# EAGLE design 5-leds (EAGLE 7.1.0)
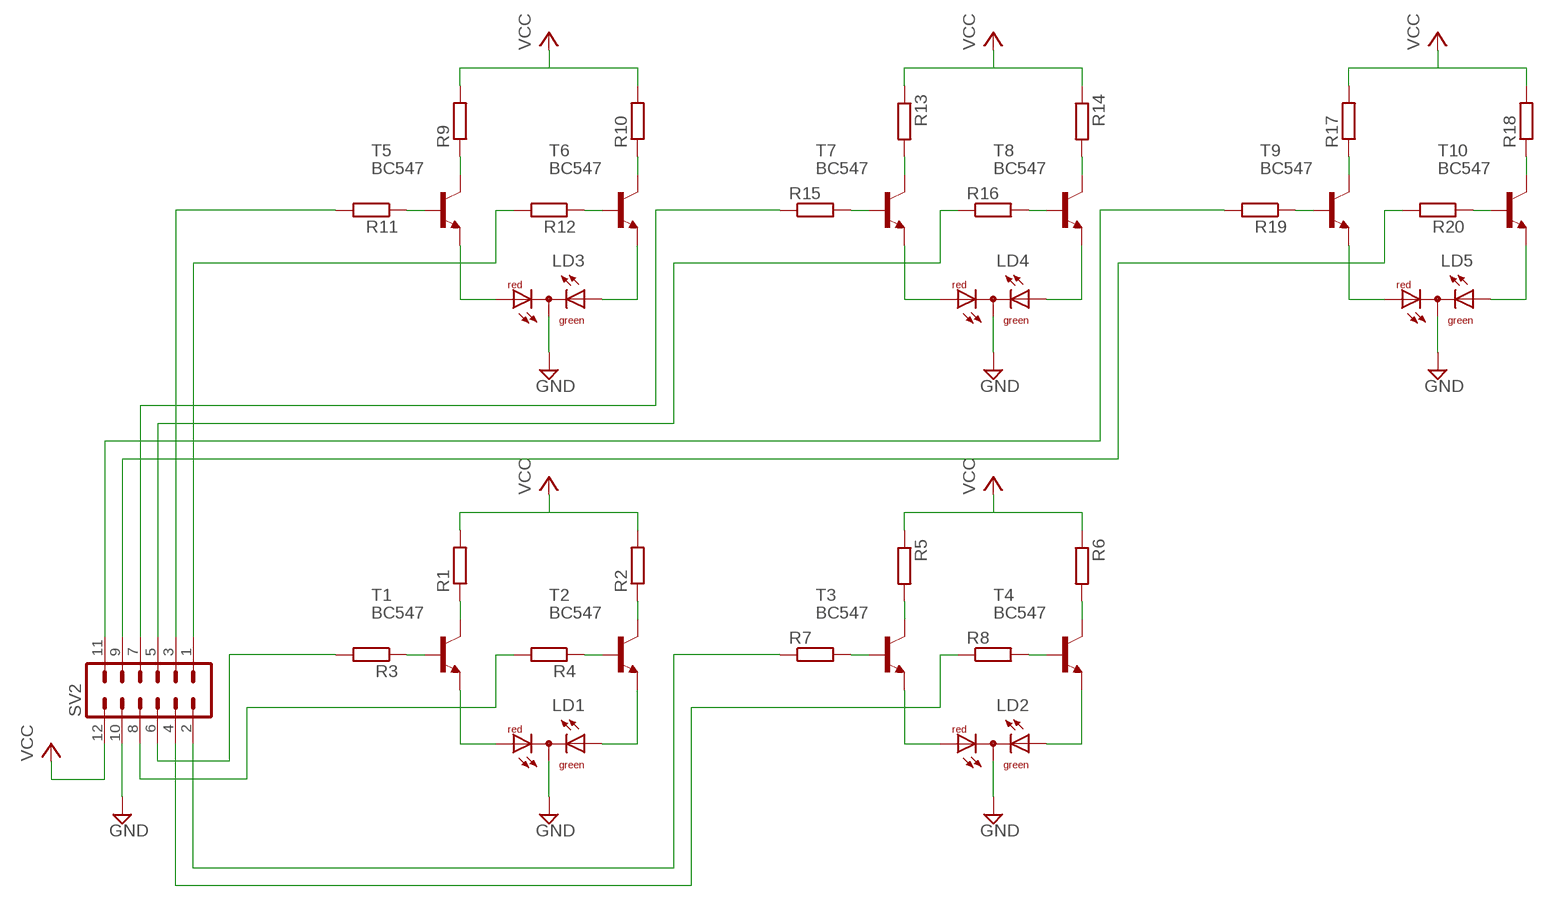
[diagram p0: schematic, sheet 1]

## Parts
LD1  DUOLED-RG-C  [DUOLED-C-5MM]
LD2  DUOLED-RG-C  [DUOLED-C-5MM]
LD3  DUOLED-RG-C  [DUOLED-C-5MM]
LD4  DUOLED-RG-C  [DUOLED-C-5MM]
LD5  DUOLED-RG-C  [DUOLED-C-5MM]
R1  R-EU_0207/7  [0207/7]
R2  R-EU_0207/7  [0207/7]
R3  R-EU_0207/7  [0207/7]
R4  R-EU_0207/7  [0207/7]
R5  R-EU_0207/7  [0207/7]
R6  R-EU_0207/7  [0207/7]
R7  R-EU_0207/7  [0207/7]
R8  R-EU_0207/7  [0207/7]
R9  R-EU_0207/7  [0207/7]
R10  R-EU_0207/7  [0207/7]
R11  R-EU_0207/7  [0207/7]
R12  R-EU_0207/7  [0207/7]
R13  R-EU_0207/7  [0207/7]
R14  R-EU_0207/7  [0207/7]
R15  R-EU_0207/7  [0207/7]
R16  R-EU_0207/7  [0207/7]
R17  R-EU_0207/7  [0207/7]
R18  R-EU_0207/7  [0207/7]
R19  R-EU_0207/7  [0207/7]
R20  R-EU_0207/7  [0207/7]
SV2  MA06-2  [MA06-2]
T1  BC547  [TO92]
T2  BC547  [TO92]
T3  BC547  [TO92]
T4  BC547  [TO92]
T5  BC547  [TO92]
T6  BC547  [TO92]
T7  BC547  [TO92]
T8  BC547  [TO92]
T9  BC547  [TO92]
T10  BC547  [TO92]

## Nets
GND: LD1.C LD2.C LD3.C LD4.C LD5.C SV2.10
N$1: LD1.AR T1.1(E)
N$2: LD1.AX(AG) T2.1(E)
N$3: R3.1 T1.2(B)
N$4: R4.1 T2.2(B)
N$5: R4.2 SV2.8
N$6: R3.2 SV2.6
N$7: R1.1 T1.3(C)
N$8: R2.1 T2.3(C)
N$10: LD2.AR T3.1(E)
N$11: LD2.AX(AG) T4.1(E)
N$12: R8.1 SV2.4
N$13: R5.2 T3.3(C)
N$14: R6.2 T4.3(C)
N$15: R7.2 T3.2(B)
N$16: R8.2 T4.2(B)
N$17: R7.1 SV2.2
N$18: LD3.AR T5.1(E)
N$19: LD3.AX(AG) T6.1(E)
N$20: R12.2 SV2.1
N$21: R9.1 T5.3(C)
N$22: R10.1 T6.3(C)
N$23: R11.1 T5.2(B)
N$24: R12.1 T6.2(B)
N$25: R11.2 SV2.3
N$26: LD4.AR T7.1(E)
N$27: LD4.AX(AG) T8.1(E)
N$28: R16.1 SV2.5
N$29: R13.2 T7.3(C)
N$30: R14.2 T8.3(C)
N$31: R15.2 T7.2(B)
N$32: R16.2 T8.2(B)
N$33: R15.1 SV2.7
N$34: LD5.AR T9.1(E)
N$35: LD5.AX(AG) T10.1(E)
N$36: R20.2 SV2.9
N$37: R17.1 T9.3(C)
N$38: R18.1 T10.3(C)
N$39: R19.1 T9.2(B)
N$40: R20.1 T10.2(B)
N$41: R19.2 SV2.11
VCC: R1.2 R2.2 R5.1 R6.1 R9.2 R10.2 R13.1 R14.1 R17.2 R18.2 SV2.12

## Library data of the parts
LD1-LD5 = led:DUOLED-RG-C: DUO LED 2 colors (red/green), 5 mm, round, common Cathode www.ligitek.com or other producers.
R1-R20 = rcl:R-EU_: RESISTOR, European symbol
SV2 = con-lstb:MA06-2: PIN HEADER; OC_FARNELL: unknown; OC_NEWARK: unknown
T1-T10 = transistor:BC547: NPN TRANSISTOR

## Board
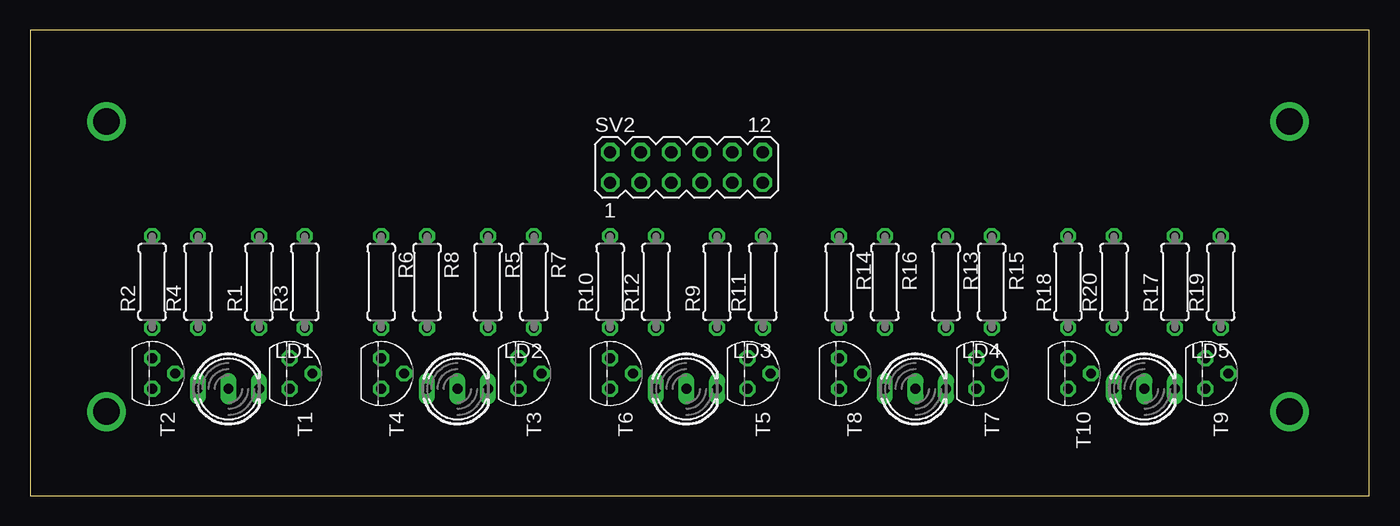
[diagram p1: board, top side]
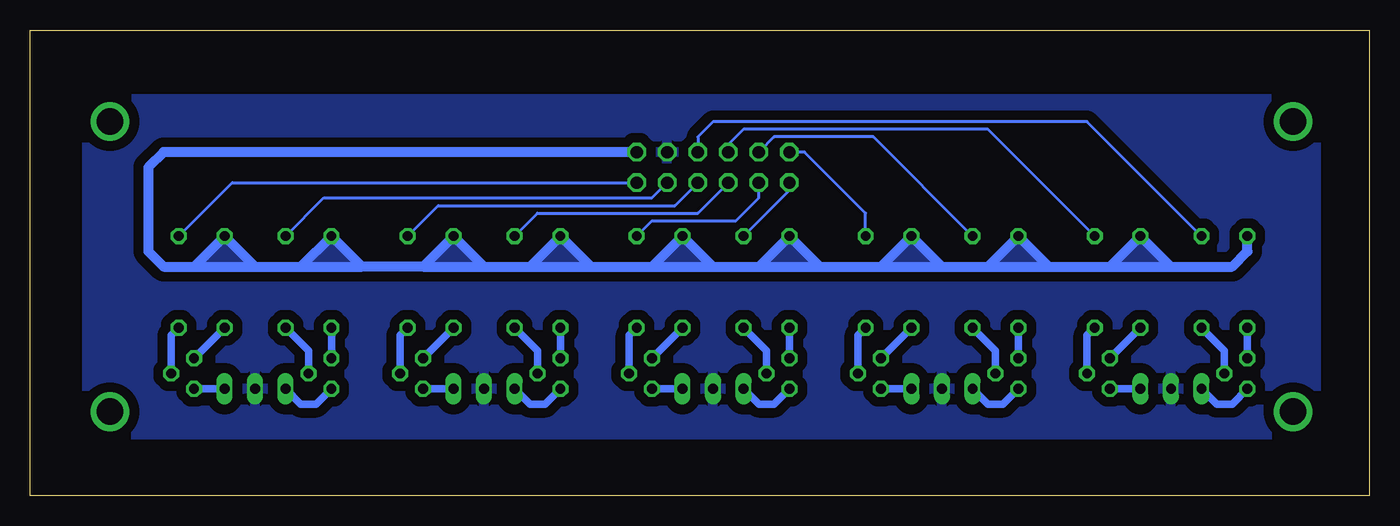
[diagram p2: board, bottom side, seen from below]

Size 111.43 x 38.73 mm. Coordinates in mm from the lower left corner, seen from the top.
Outline: 0,0 111.43,0 111.43,38.73 0,38.73 0,0
Copper layers (1*16): Top 0.035mm / dielectric 1.5mm / Bottom 0.035mm
Design rules "default": minimum track width 10mil, minimum drill 24mil, track to track 8mil, track to pad 8mil, pad to pad 8mil, via to via 8mil, smd to smd 8mil, copper to edge 40mil, drill to drill 8mil, minimum pad ring 10mil, minimum via ring 8mil, stop-mask expansion 4mil, vias tented up to drill 0mil, thermal gap 10mil

### Footprints (pad centres in the part's own frame; a part is rotated, then mirrored left to right if it is on the bottom)
DUOLED-C-5MM = drill 0.813 long: AR 2.54,0; AX -2.54,0; C 0,0
0207/7 = drill 0.813 octagon: 1 -3.81,0; 2 3.81,0
MA06-2 = drill 1.016 octagon: 1 -6.35,-1.27; 2 -6.35,1.27; 3 -3.81,-1.27; 4 -3.81,1.27; 5 -1.27,-1.27; 6 -1.27,1.27; 7 1.27,-1.27; 8 1.27,1.27; 9 3.81,-1.27; 10 3.81,1.27; 11 6.35,-1.27; 12 6.35,1.27
TO92 = drill 0.813 octagon: 1 1.27,0; 2 0,1.905; 3 -1.27,0

### Placement (x,y rotation side)
LD1  16.51,8.89 0 top
LD2  35.56,8.89 0 top
LD3  54.61,8.89 0 top
LD4  73.66,8.89 0 top
LD5  92.71,8.89 0 top
R1  19.05,17.78 90 top
R2  10.16,17.78 90 top
R3  22.86,17.78 90 top
R4  13.97,17.78 90 top
R5  38.1,17.78 270 top
R6  29.21,17.78 270 top
R7  41.91,17.78 270 top
R8  33.02,17.78 270 top
R9  57.15,17.78 90 top
R10  48.26,17.78 90 top
R11  60.96,17.78 90 top
R12  52.07,17.78 90 top
R13  76.2,17.78 270 top
R14  67.31,17.78 270 top
R15  80.01,17.78 270 top
R16  71.12,17.78 270 top
R17  95.25,17.78 90 top
R18  86.36,17.78 90 top
R19  99.06,17.78 90 top
R20  90.17,17.78 90 top
SV2  54.61,27.3 0 top
T1  21.59,10.16 270 top
T2  10.16,10.16 270 top
T3  40.64,10.16 270 top
T4  29.21,10.16 270 top
T5  59.69,10.16 270 top
T6  48.26,10.16 270 top
T7  78.74,10.16 270 top
T8  67.31,10.16 270 top
T9  97.79,10.16 270 top
T10  86.36,10.16 270 top

### Tracks (layer width: path | path; a pad name or v marks a point on that pad's centre or on a via)
GND
  pour Bottom (isolate 0.813): 4.45,5.08 106.68,5.08 106.68,33.02 4.45,33.02
N$1
  Bottom 0.61: T1.1 LD1.AR
N$2
  Bottom 0.61: T2.1 11.43,7.62 12.7,7.62 LD1.AX
N$3
  Bottom 0.61: T1.2 23.5,13.34 R3.1
N$4
  Bottom 0.61: T2.2 12.06,12.06 R4.1
N$5
  Bottom 0.254: R4.2 23.5,31.11 54.61,31.11 55.88,29.84 SV2.8
N$6
  Bottom 0.254: R3.2 31.75,30.48 52.07,30.48 53.34,29.21 SV2.6
N$7
  Bottom 0.61: T1.3 R1.1
N$8
  Bottom 0.61: T2.3 R2.1
N$9  (via drill 2.2 pad 1.93)
  other vias: 6.35,31.11
N$10
  Bottom 0.61: LD2.AR T3.1
N$11
  Bottom 0.61: LD2.AX 31.75,7.62 30.48,7.62 T4.1
N$12
  Bottom 0.254: R8.1 41.27,29.84 49.53,29.84 SV2.4
N$13
  Bottom 0.61: T3.3 R5.2
N$14
  Bottom 0.61: T4.3 R6.2
N$15
  Bottom 0.61: T3.2 42.55,13.34 R7.2
N$16
  Bottom 0.61: T4.2 31.11,12.06 R8.2
N$17
  Bottom 0.254: R7.1 41.91,23.5 46.99,28.57 SV2.2
N$18
  Bottom 0.61: LD3.AR T5.1
N$19
  Bottom 0.61: LD3.AX 50.8,7.62 49.53,7.62 T6.1
N$20
  Bottom 0.254: R12.2 48.26,25.4 SV2.1
N$21
  Bottom 0.61: T5.3 R9.1
N$22
  Bottom 0.61: T6.3 R10.1
N$23
  Bottom 0.61: T5.2 61.59,13.34 R11.1
N$24
  Bottom 0.61: T6.2 50.16,12.06 R12.1
N$25
  Bottom 0.254: R11.2 59.69,22.86 52.7,22.86 50.8,24.77 SV2.3
N$26
  Bottom 0.61: T7.1 LD4.AR
N$27
  Bottom 0.61: LD4.AX 69.85,7.62 68.58,7.62 T8.1
N$28
  Bottom 0.254: R16.1 69.22,23.5 55.88,23.5 SV2.5
N$29
  Bottom 0.61: T7.3 R13.2
N$30
  Bottom 0.61: T8.3 R14.2
N$31
  Bottom 0.61: T7.2 80.64,13.34 R15.2
N$32
  Bottom 0.61: T8.2 69.22,12.06 R16.2
N$33
  Bottom 0.254: R15.1 77.47,24.13 57.78,24.13 SV2.7
N$34
  Bottom 0.61: T9.1 LD5.AR
N$35
  Bottom 0.61: LD5.AX 88.9,7.62 87.63,7.62 T10.1
N$36
  Bottom 0.254: R20.2 87,24.77 59.69,24.77 SV2.9
N$37
  Bottom 0.61: T9.3 R17.1
N$38
  Bottom 0.61: T10.3 R18.1
N$39
  Bottom 0.61: T9.2 99.69,13.34 R19.1
N$40
  Bottom 0.61: T10.2 88.27,12.06 R20.1
N$41
  Bottom 0.254: R19.2 94.61,26.04 SV2.11
N$42  (via drill 2.2 pad 1.93)
  other vias: 6.35,6.99
N$43  (via drill 2.2 pad 1.93)
  other vias: 104.78,6.99
N$44  (via drill 2.2 pad 1.93)
  other vias: 104.78,31.11
VCC
  Bottom 0.813: SV2.12 100.33,28.57 101.6,27.3 101.6,20.32 100.33,19.05 97.79,19.05 | 97.79,19.05 88.9,19.05 | 88.9,19.05 83.82,19.05 | 78.74,19.05 73.66,19.05 | 73.66,19.05 69.85,19.05 | 69.85,19.05 64.77,19.05 | 64.77,19.05 59.69,19.05 | 59.69,19.05 54.61,19.05 | 54.61,19.05 50.8,19.05 | 50.8,19.05 45.72,19.05 | 45.72,19.05 40.64,19.05 | 40.64,19.05 35.56,19.05 | 35.56,19.05 31.75,19.05 | 31.75,19.05 26.67,19.05 | 26.67,19.05 21.59,19.05 | 21.59,19.05 16.51,19.05 | 16.51,19.05 11.43,19.05 10.16,20.32 R2.2 | 16.51,19.05 R1.2 21.59,19.05 | 26.67,19.05 R6.1 31.75,19.05 | 35.56,19.05 R5.1 40.64,19.05 | 45.72,19.05 R10.2 50.8,19.05 | 54.61,19.05 R9.2 59.69,19.05 | 64.77,19.05 R14.1 69.85,19.05 | 73.66,19.05 R13.1 78.74,19.05 | 78.74,19.05 83.82,19.05 | 83.82,19.05 R18.2 88.9,19.05 | 92.71,19.05 R17.2 97.79,19.05
  pour Bottom: 19.05,21.59 16.51,19.05 21.59,19.05
  pour Bottom: 29.21,21.59 26.67,19.05 31.75,19.05
  pour Bottom: 38.1,21.59 35.56,19.05 40.64,19.05
  pour Bottom: 48.26,21.59 45.72,19.05 50.8,19.05
  pour Bottom: 57.15,21.59 54.61,19.05 59.69,19.05
  pour Bottom: 67.31,21.59 64.77,19.05 69.85,19.05
  pour Bottom: 76.2,21.59 73.66,19.05 78.74,19.05
  pour Bottom: 86.36,21.59 83.82,19.05 88.9,19.05
  pour Bottom: 95.25,21.59 92.71,19.05 97.79,19.05